# EAGLE schematic OTA_VCA_Test (EAGLE 7.2.0)
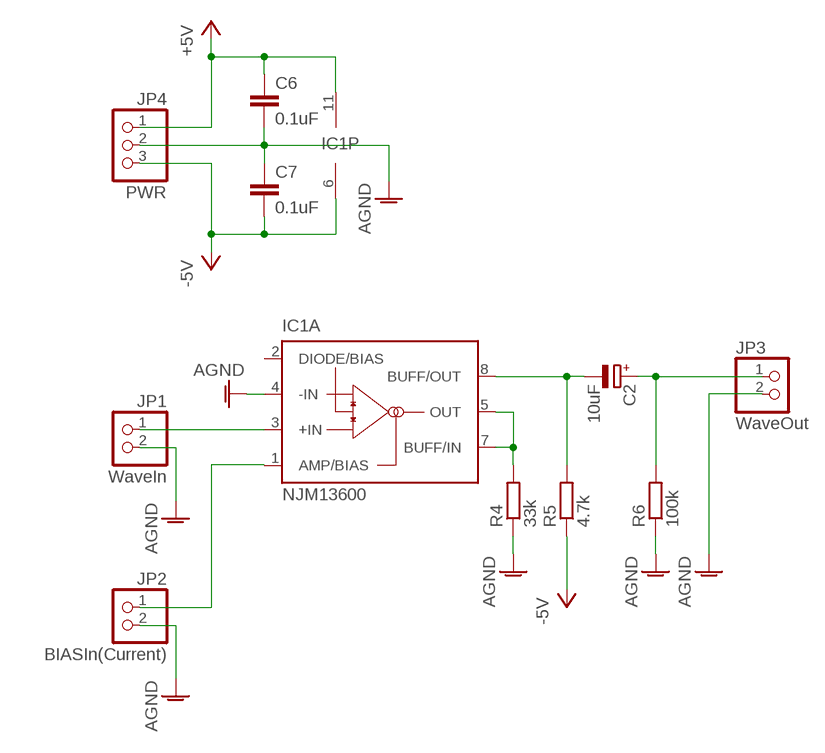
[diagram p0: schematic, sheet 1]

## Parts
C2  10uF  CPOL-EUE2.5-7  [E2,5-7]
C6  0.1uF  C-EU025-024X044  [C025-024X044]
C7  0.1uF  C-EU025-024X044  [C025-024X044]
IC1  NJM13600  LM13600N  [DIL16]
JP1  WaveIn  PINHD-1X2  [1X02]
JP2  BIASIn(Current)  PINHD-1X2  [1X02]
JP3  WaveOut  PINHD-1X2  [1X02]
JP4  PWR  PINHD-1X3  [1X03]
R4  33k  R-EU_0207/7  [0207/7]
R5  4.7k  R-EU_0207/7  [0207/7]
R6  100k  R-EU_0207/7  [0207/7]

## Nets
+5V: C6.1 IC1.11(P:V+) JP4.1
-5V: C7.2 IC1.6(P:V-) JP4.3 R5.1
AGND: C6.2 C7.1 IC1.4(A:-IN) JP1.2 JP2.2 JP3.2 JP4.2 R4.1 R6.1
N$1: IC1.3(A:+IN) JP1.1
N$5: IC1.5(A:OUT) IC1.7(A:BUFF/IN) R4.2
N$6: C2.- IC1.8(A:BUFF/OUT) R5.2
N$8: C2.+ JP3.1 R6.2
N$14: IC1.1(A:AMP/BIAS) JP2.1
Unconnected: IC1.2(A:DIODE/BIAS) IC1.9(B:BUFF/OUT) IC1.10(B:BUFF/IN) IC1.12(B:OUT) IC1.13(B:-IN) IC1.14(B:+IN) IC1.15(B:DIODE/BIAS) IC1.16(B:AMP/BIAS)

## Library data of the parts
C2 = rcl:CPOL-EU: POLARIZED CAPACITOR, European symbol
C6 C7 = rcl:C-EU: CAPACITOR, European symbol
IC1 = national-semiconductor:LM13600: Dual Operational Transconductance Amplifiers with Linearizing Diodes and Buffers Source: lm13600.PDF
JP1-JP3 = pinhead:PINHD-1X2: PIN HEADER
JP4 = pinhead:PINHD-1X3: PIN HEADER
R4-R6 = rcl:R-EU_: RESISTOR, European symbol